# EAGLE design Board_2 (EAGLE 8.7.0)

## Sheet 1 of 3
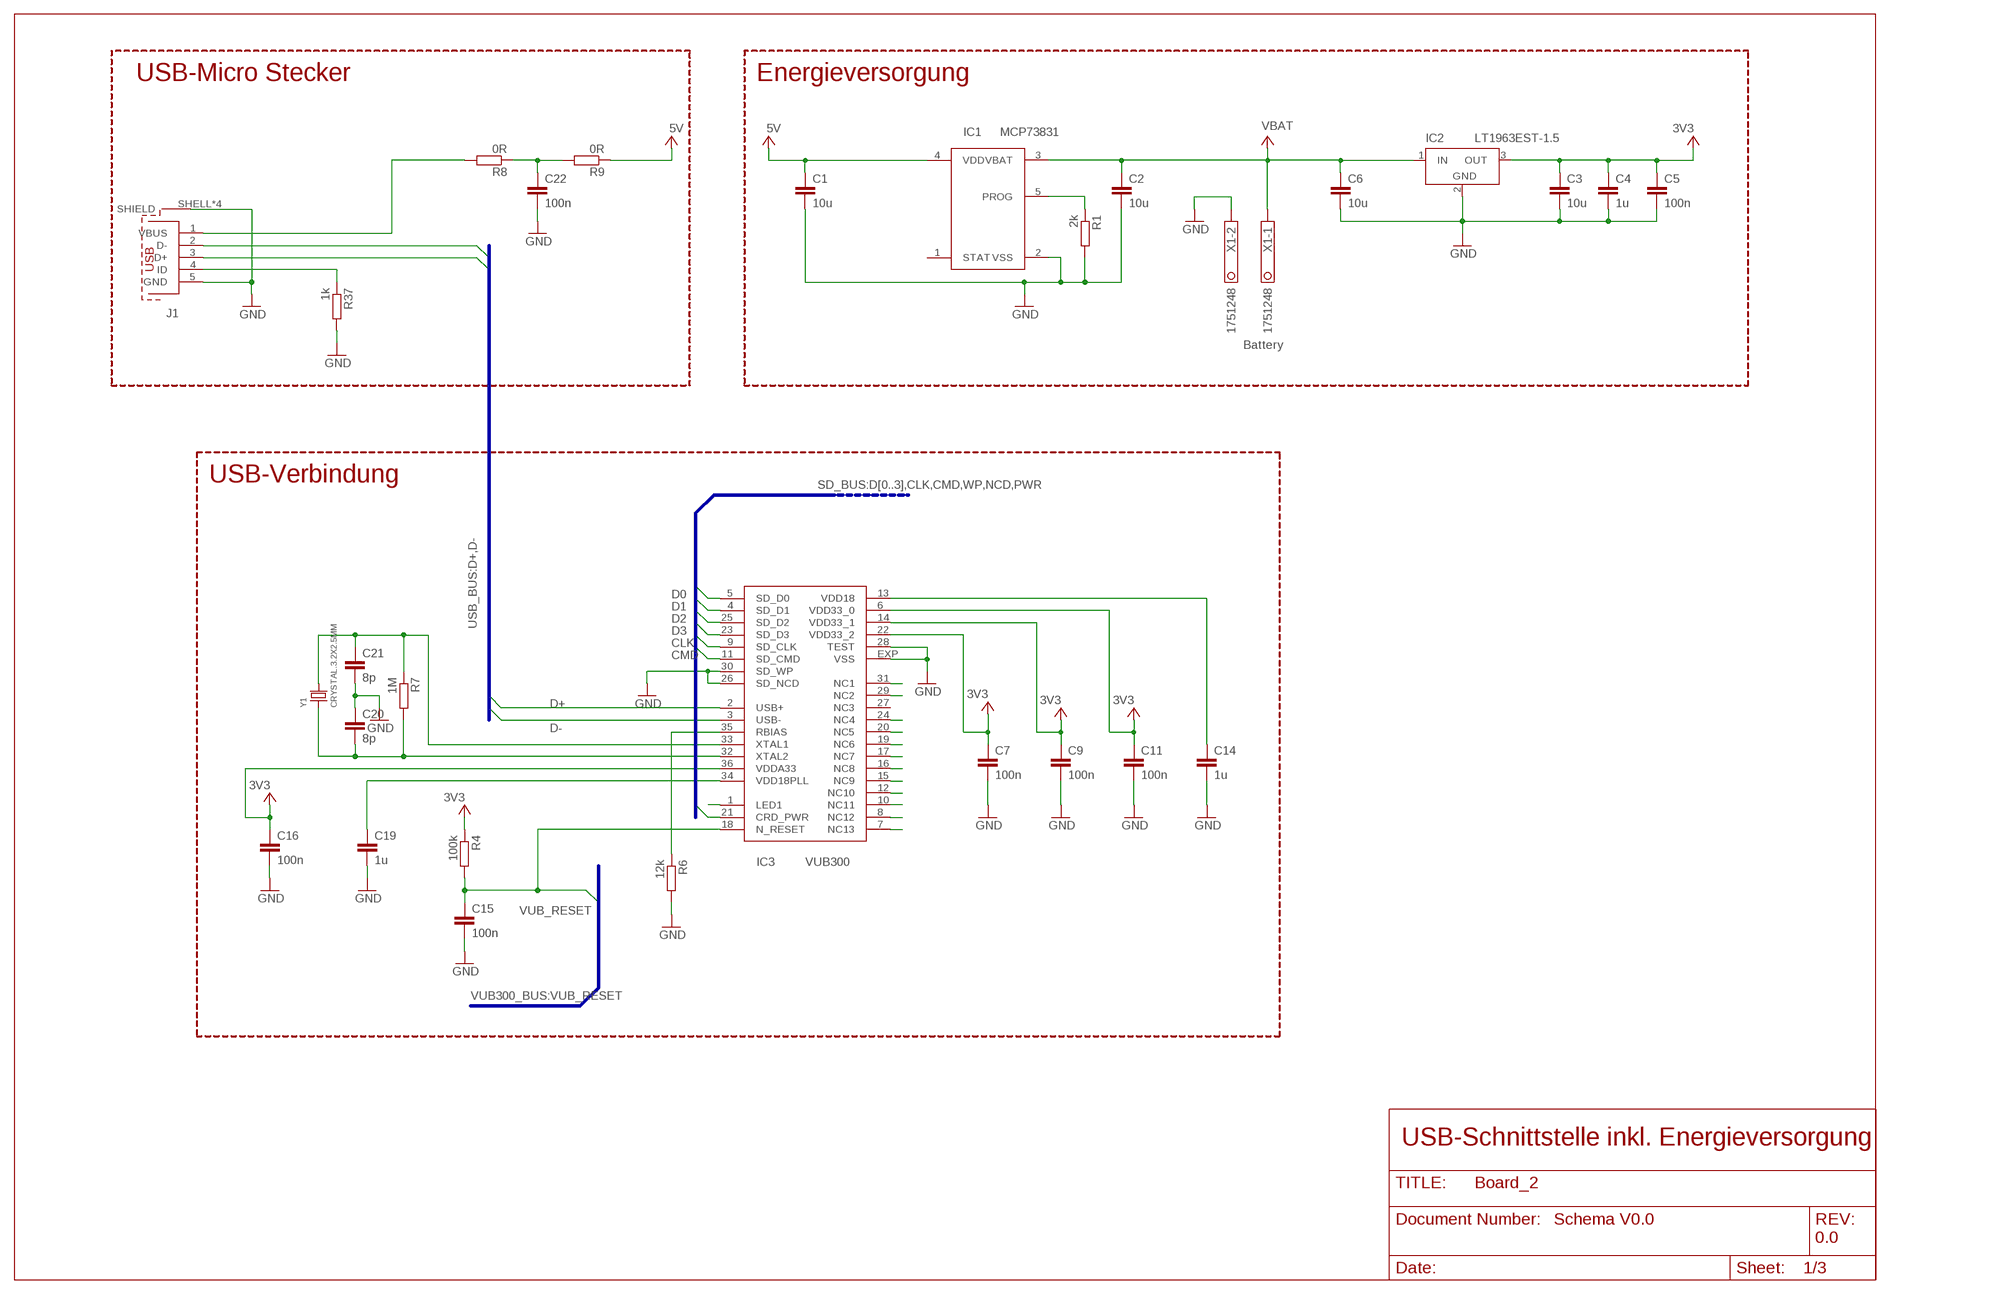
[diagram p0: schematic, sheet 1]

### Parts
C1  10u  C-EUC0805  [C0805]
C2  10u  C-EUC0805  [C0805]
C3  10u  C-EUC0805  [C0805]
C4  1u  C-EUC0603  [C0603]
C5  100n  C-EUC0603  [C0603]
C6  10u  C-EUC0805  [C0805]
C7  100n  C-EUC0402  [C0402]
C9  100n  C-EUC0402  [C0402]
C11  100n  C-EUC0402  [C0402]
C14  1u  C-EUC0402  [C0402]
C15  100n  C-EUC0402  [C0402]
C16  100n  C-EUC0402  [C0402]
C19  1u  C-EUC0402  [C0402]
C20  8p  C-EUC0402  [C0402]
C21  8p  C-EUC0402  [C0402]
C22  100n  C-EUC0603  [C0603]
IC1  MCP73831  [SOT23-5]
IC2  LT1963EST-1.5  [SOT223]
IC3  VUB300  [QFN36-6X6]
J1  629105136821  [629105136821]
R1  2k  R-EU_R0603  [R0603]
R4  100k  R-EU_R0402  [R0402]
R6  12k  R-EU_R0402  [R0402]
R7  1M  R-EU_R0402  [R0402]
R8  0R  R-EU_R0603  [R0603]
R9  0R  R-EU_R0603  [R0603]
R37  1k  R-EU_R0402  [R0402]
X1  1751248  [1751248]
Y1  CRYSTAL.3.2X2.5MM  [3.2X2.5MM]

### Nets
+3V3: C3.1 C4.1 C5.1 C7.1 C9.1 C11.1 C16.1 IC2.3(OUT) IC3.6(VDD33_0) IC3.14(VDD33_1) IC3.22(VDD33_2) IC3.36(VDDA33) R4.1 ; supply symbol labelled 3V3 ; also sheet 2,3
+5V: C1.1 IC1.4(VDD) R9.1 ; supply symbol labelled 5V
CLK: IC3.9(SD_CLK) ; also sheet 2
CMD: IC3.11(SD_CMD) ; also sheet 2
D0: IC3.5(SD_D0) ; also sheet 2
D1: IC3.4(SD_D1) ; also sheet 2
D2: IC3.25(SD_D2) ; also sheet 2
D3: IC3.23(SD_D3) ; also sheet 2
D+: IC3.2(USB+) J1.3(D+)
D-: IC3.3(USB-) J1.2(D-)
GND: C1.2 C2.2 C3.2 C4.2 C5.2 C6.2 C7.2 C9.2 C11.2 C14.2 C15.2 C16.2 C19.2 C20.1 C21.2 C22.2 IC1.2(VSS) IC2.2(GND) IC3.26(SD_NCD) IC3.28(TEST) IC3.30(SD_WP) IC3.EXP(VSS) J1.5(GND) J1.SHELL1(SHIELD) J1.SHELL2(SHIELD) J1.SHELL3(SHIELD) J1.SHELL(SHIELD) R1.2 R6.2 R37.2 X1.2 ; also sheet 2,3
N$1: IC1.5(PROG) R1.1
N$4: IC3.1(LED1)
N$5: J1.4(ID) R37.1
N$19: IC3.8(NC12)
N$20: IC3.7(NC13)
N$21: IC3.10(NC11)
N$22: IC3.12(NC10)
N$23: IC3.24(NC4)
N$24: IC3.15(NC9)
N$25: IC3.16(NC8)
N$26: IC3.17(NC7)
N$29: IC3.19(NC6)
N$30: IC3.20(NC5)
N$31: IC3.35(RBIAS) R6.1
N$32: IC3.29(NC2)
N$33: IC3.31(NC1)
N$34: J1.1(VBUS) R8.2
N$35: C20.2 IC3.32(XTAL2) R7.2 Y1.1
N$36: C21.1 IC3.33(XTAL1) R7.1 Y1.3
N$37: C22.1 R8.1 R9.2
PWR: IC3.21(CRD_PWR) ; also sheet 2
V+: C2.1 C6.1 IC1.3(VBAT) IC2.1(IN) X1.1 ; supply symbol labelled VBAT ; also sheet 3
VDD18: C14.1 IC3.13(VDD18)
VDD18PLL: C19.1 IC3.34(VDD18PLL)
VUB_RESET: C15.1 IC3.18(N_RESET) R4.2 ; also sheet 3
Unconnected: IC1.1(STAT) IC3.27(NC3)

### Buses
SD_BUS:D[0..3],CLK,CMD,WP,NCD,PWR
USB_BUS:D+,D-
VUB300_BUS:VUB_RESET

### Notes on the sheet
- USB-Micro Stecker | Energieversorgung
- Battery
- USB-Verbindung
- USB-Schnittstelle inkl. Energieversorgung
- Schema V0.0
- 0.0

## Sheet 2 of 3
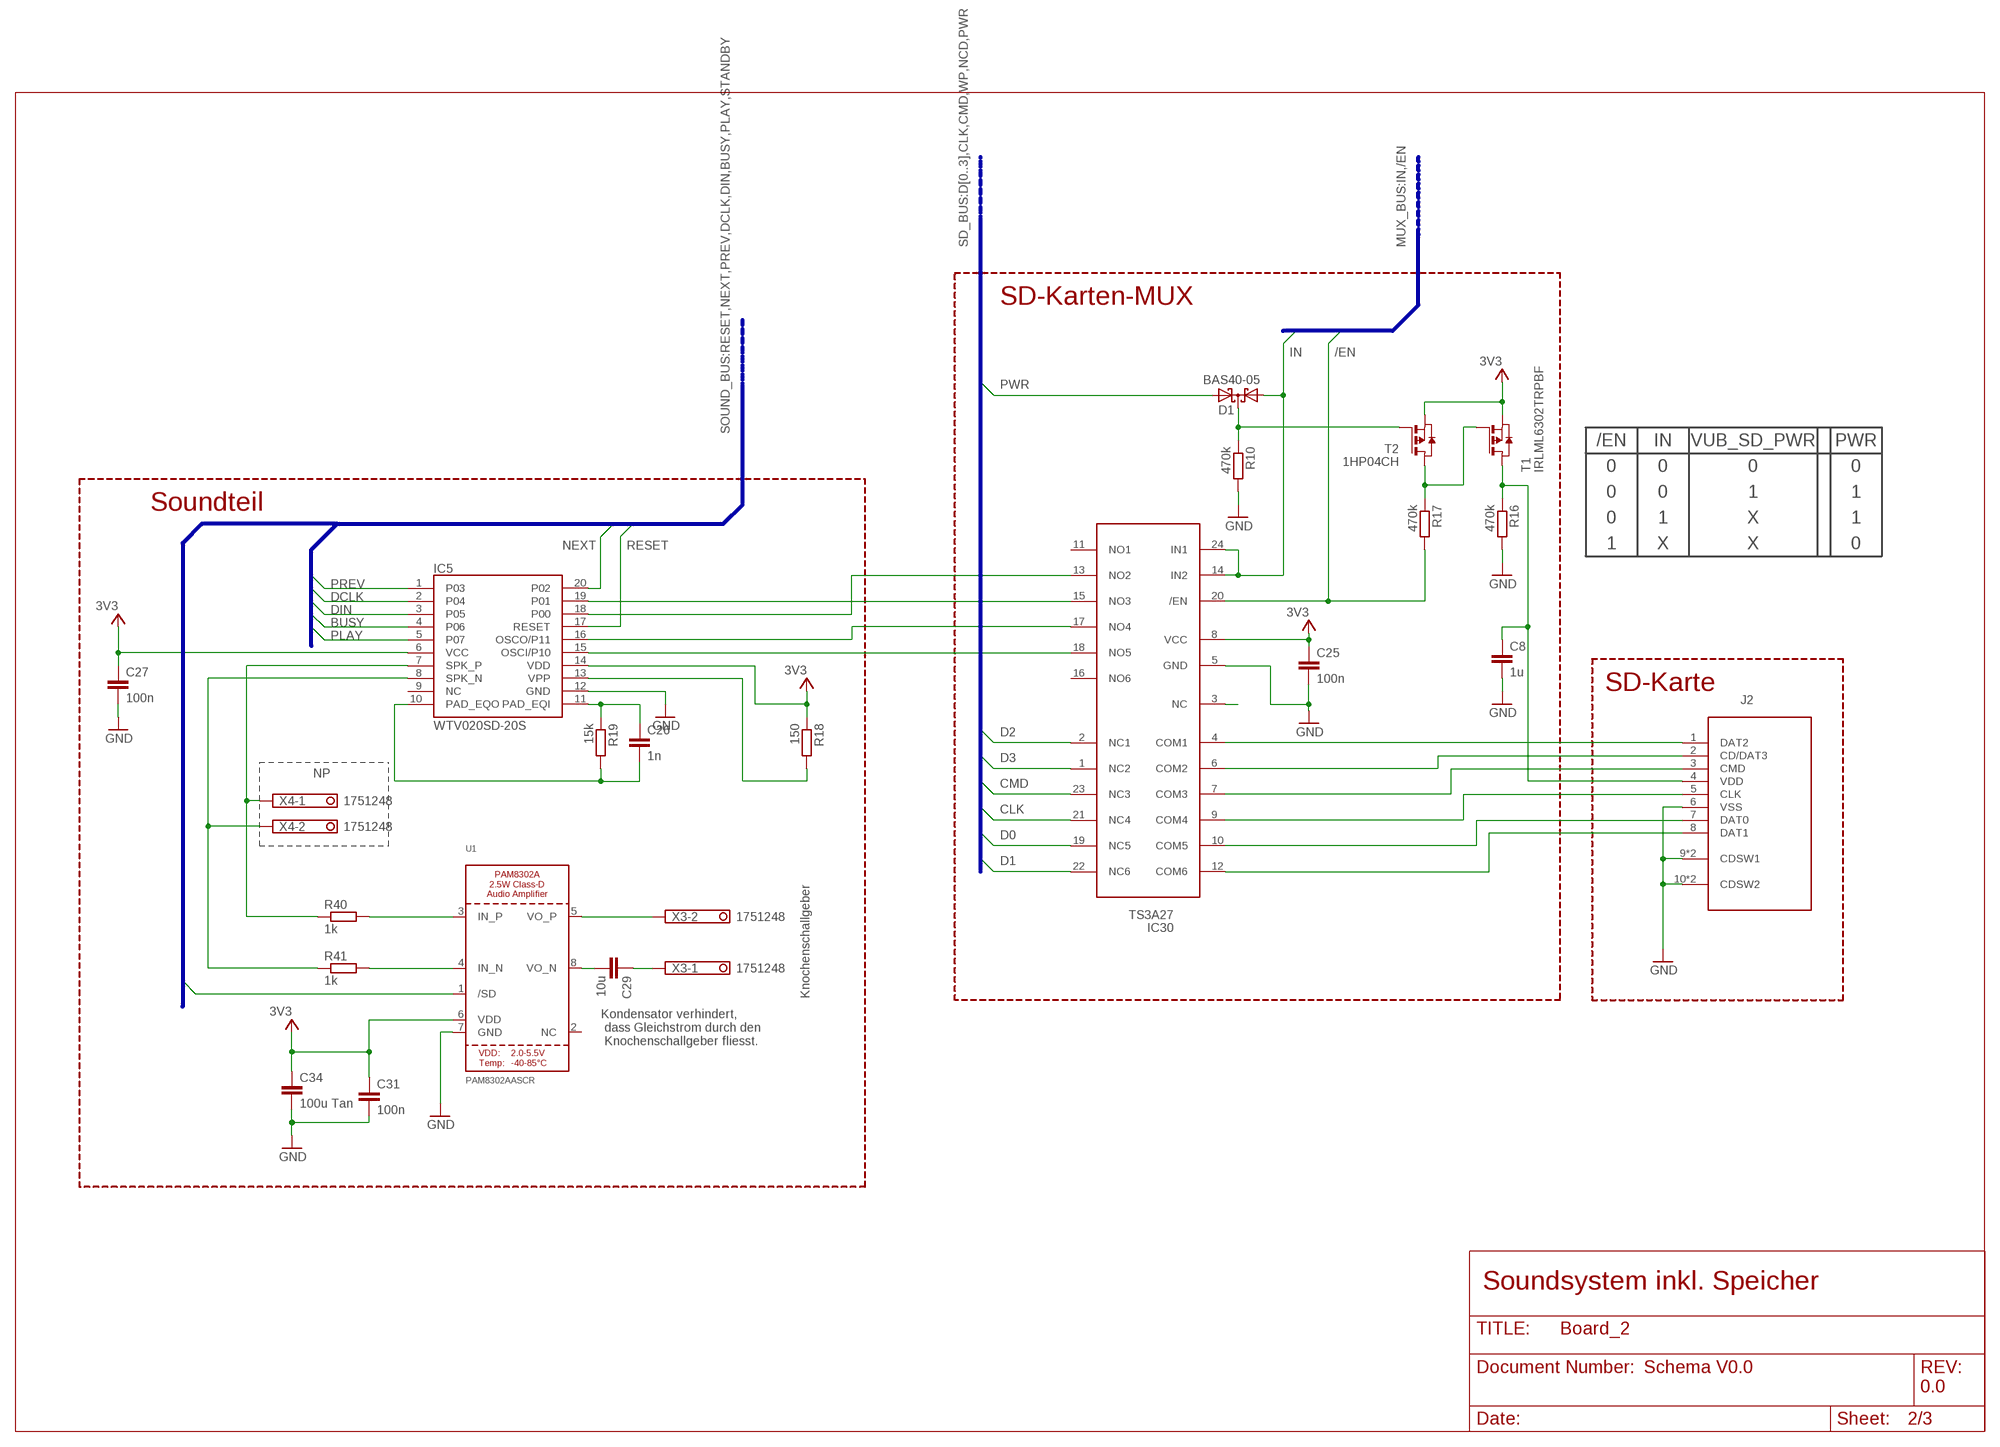
[diagram p1: schematic, sheet 2]

### Parts
C8  1u  C-EUC0603  [C0603]
C25  100n  C-EUC0603  [C0603]
C26  1n  C-EUC0402  [C0402]
C27  100n  C-EUC0402  [C0402]
C29  10u  C-EUC0603  [C0603]
C31  100n  C-EUC0603  [C0603]
C34  100u Tan  C-EUC1206  [C1206]
D1  BAS40-05  [SOT23]
IC5  WTV020SD-20S  WTV020SD  [SSOP_20]
IC30  TS3A27  [TSSOP24]
J2  693071010811  [693071010811]
R10  470k  R-EU_R0603  [R0603]
R16  470k  R-EU_R0603  [R0603]
R17  470k  R-EU_R0603  [R0603]
R18  150  R-EU_R0402  [R0402]
R19  15k  R-EU_R0402  [R0402]
R40  1k  R-EU_R0402  [R0402]
R41  1k  R-EU_R0402  [R0402]
T1  IRLML6302TRPBF  PMOSSOT23  [SOT-23]
T2  1HP04CH  PMOSSOT23  [SOT-23]
U1  PAM8302AASCR  AUDIOAMP_PAM8302A  [MSOP8_0.65MM]
X3  1751248  [1751248]
X4  1751248  [1751248]

### Nets
+3V3: C25.1 C27.1 C31.1 C34.1 IC5.6(VCC) IC5.14(VDD) IC30.8(VCC) R18.1 T1.2(S) T2.2(S) U1.6(VDD) ; supply symbol labelled 3V3 ; also sheet 1,3
/EN: IC30.20(/EN) R17.2 ; also sheet 3
BUSY: IC5.4(P06) ; also sheet 3
CLK: IC30.21(NC4) ; also sheet 1
CMD: IC30.23(NC3) ; also sheet 1
D0: IC30.19(NC5) ; also sheet 1
D1: IC30.22(NC6) ; also sheet 1
D2: IC30.2(NC1) ; also sheet 1
D3: IC30.1(NC2) ; also sheet 1
DCLK: IC5.2(P04) ; also sheet 3
DIN: IC5.3(P05) ; also sheet 3
GND: C8.2 C25.2 C27.2 C31.2 C34.2 IC5.12(GND) IC30.5(GND) J2.6(VSS) J2.9(CDSW1) J2.9-1(CDSW1) J2.10(CDSW2) J2.10-1(CDSW2) R10.2 R16.2 U1.7(GND) ; also sheet 1,3
IN: D1.1(A1) IC30.14(IN2) IC30.24(IN1) ; also sheet 3
N$2: R41.2 U1.4(IN_N)
N$9: IC5.19(P01) IC30.15(NO3)
N$11: R40.2 U1.3(IN_P)
N$12: U1.5(VO_P) X3.2
N$16: C29.1 X3.1
N$18: C29.2 U1.8(VO_N)
N$38: IC30.9(COM4) J2.5(CLK)
N$39: IC5.13(VPP) R18.2
N$40: C26.1 IC5.11(PAD_EQI) R19.1
N$41: IC5.16(OSCO/P11) IC30.17(NO4)
N$42: IC5.15(OSCI/P10) IC30.18(NO5)
N$43: IC30.4(COM1) J2.1(DAT2)
N$44: IC30.12(COM6) J2.8(DAT1)
N$45: IC30.6(COM2) J2.2(CD/DAT3)
N$46: R17.1 T1.3(G) T2.1(D)
N$47: IC30.3(NC)
N$49: D1.3(C) R10.1 T2.3(G)
NCD1: C8.1 J2.4(VDD) R16.1 T1.1(D)
NEXT: IC5.20(P02) ; also sheet 3
PLAY: IC5.5(P07) ; also sheet 3
PREV: IC5.1(P03) ; also sheet 3
PWM: C26.2 IC5.10(PAD_EQO) R19.2
PWR: D1.2(A2) ; also sheet 1
RESET: IC5.17(RESET) ; also sheet 3
SDCS: IC5.18(P00) IC30.13(NO2)
SDDI: IC30.7(COM3) J2.3(CMD)
SDDO: IC30.10(COM5) J2.7(DAT0)
SPK+: IC5.7(SPK_P) R40.1 X4.1
SPK-: IC5.8(SPK_N) R41.1 X4.2
Unconnected: IC5.9(NC) IC30.11(NO1) IC30.16(NO6) U1.1(/SD) U1.2(NC)

### Buses
SD_BUS:D[0..3],CLK,CMD,WP,NCD,PWR
MUX_BUS:IN,/EN
SOUND_BUS:RESET,NEXT,PREV,DCLK,DIN,BUSY,PLAY,STANDBY

### Notes on the sheet
- SD-Karten-MUX
- /EN | IN | VUB_SD_PWR | PWR
- 0 | 0 | 0 | 0
- 0 | 0 | 1 | 1
- Soundteil
- 0 | 1 | X | 1
- 1 | X | X | 0
- SD-Karte
- NP
- Knochenschallgeber
- Kondensator verhindert,
   dass Gleichstrom durch den
   Knochenschallgeber fliesst.
- Soundsystem inkl. Speicher
- Schema V0.0
- 0.0

## Sheet 3 of 3
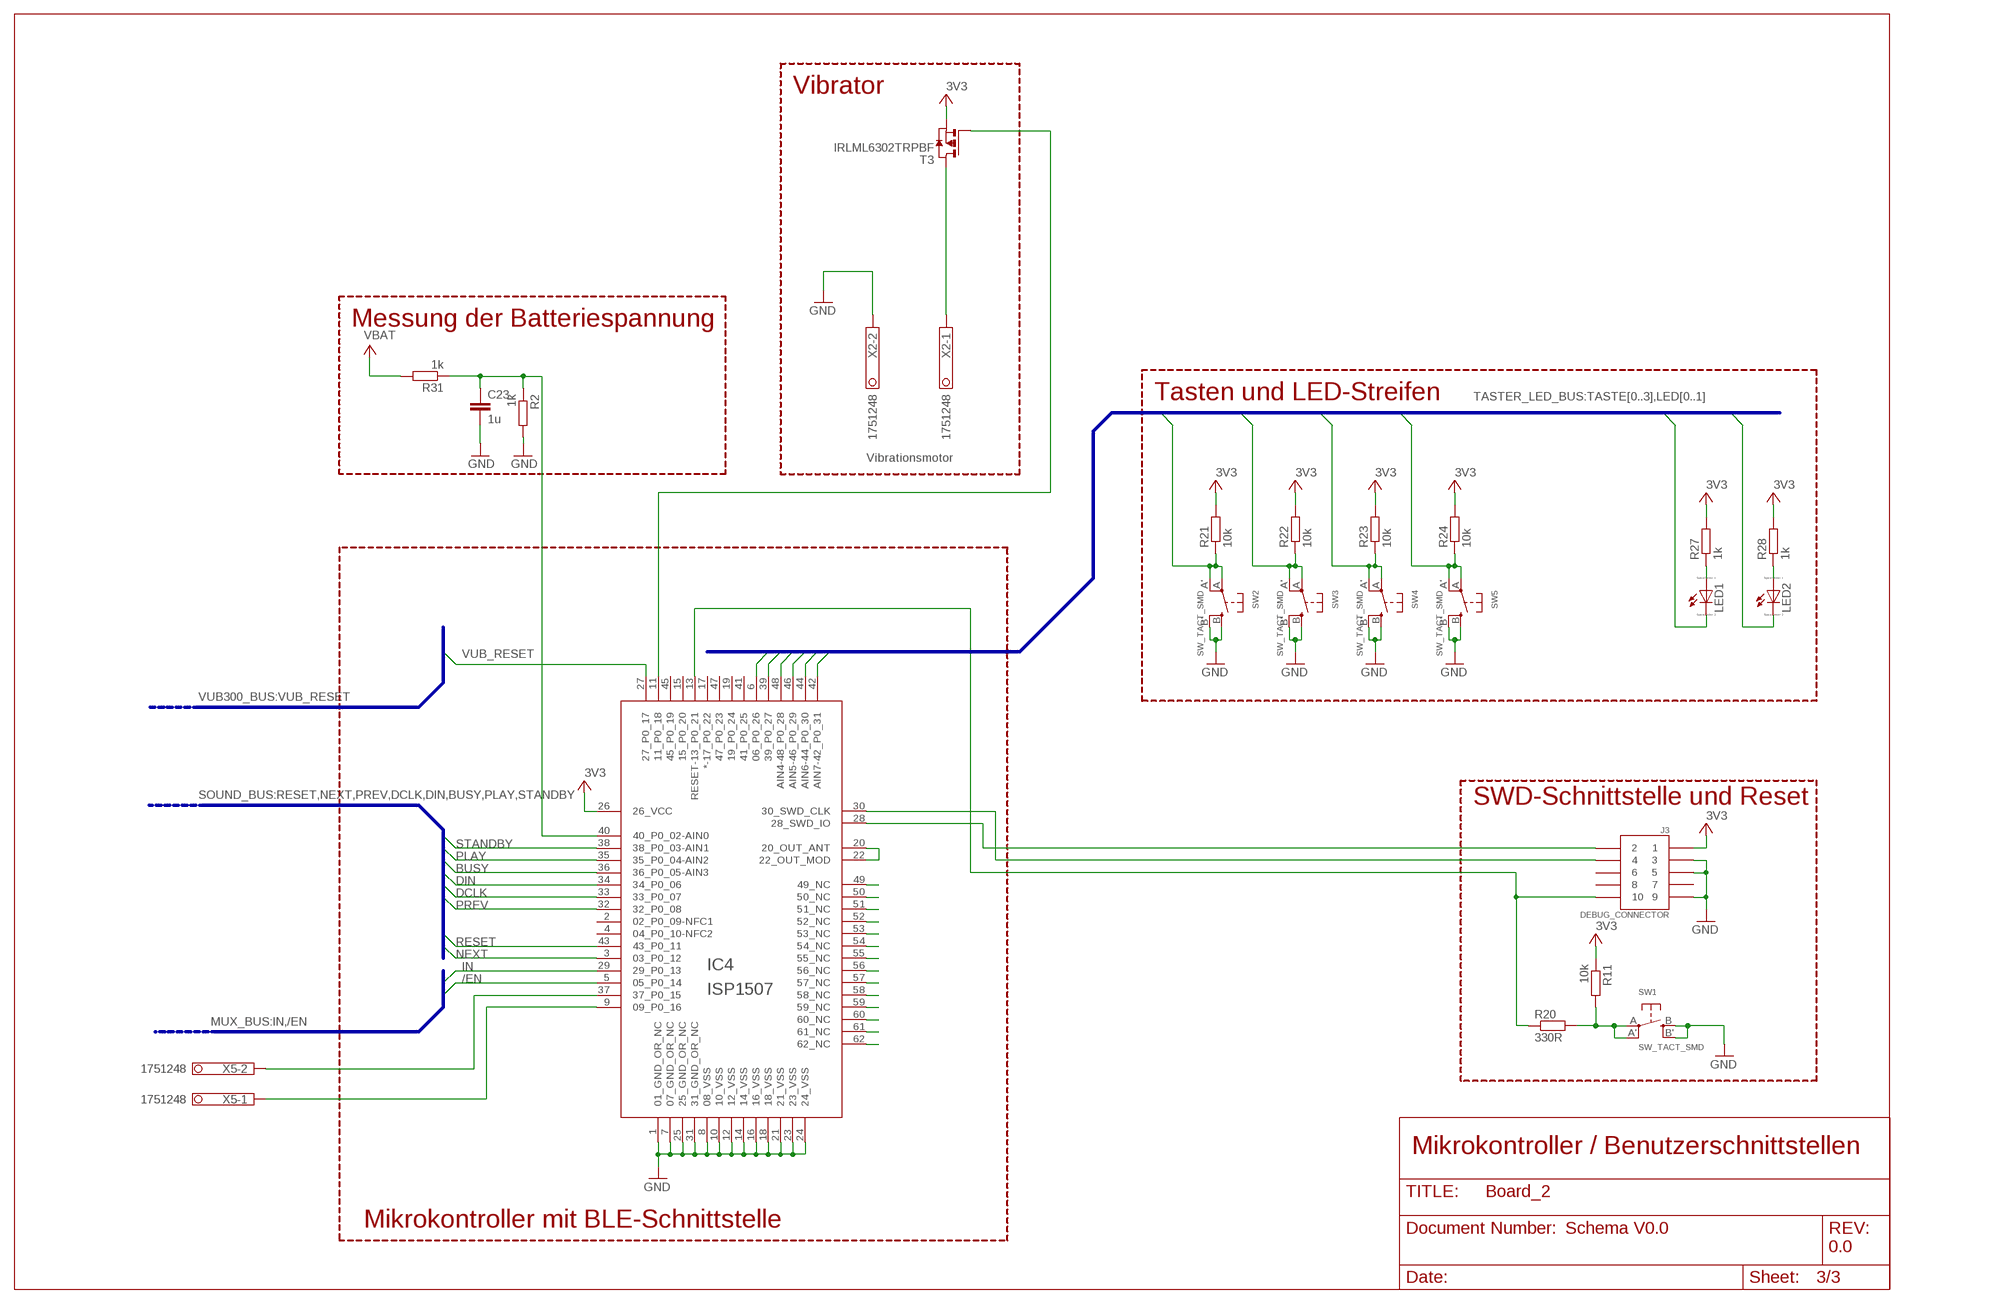
[diagram p2: schematic, sheet 3]

### Parts
C23  1u  C-EUC0603  [C0603]
IC4  ISP1507  [ISP1507]
J3  DEBUG_CONNECTOR  [HDRV127P5X2-10_N]
LED1  LED_E  [LED_1206]
LED2  LED_E  [LED_1206]
R2  1k  R-EU_R0603  [R0603]
R11  10k  R-EU_R0603  [R0603]
R20  330R  R-EU_R0603  [R0603]
R21  10k  R-EU_R0603  [R0603]
R22  10k  R-EU_R0603  [R0603]
R23  10k  R-EU_R0603  [R0603]
R24  10k  R-EU_R0603  [R0603]
R27  1k  R-EU_R0603  [R0603]
R28  1k  R-EU_R0603  [R0603]
R31  1k  R-EU_R0603  [R0603]
SW1  SW_TACT_SMD  [EVQ-Q2]
SW2  SW_TACT_SMD  [EVQ-Q2]
SW3  SW_TACT_SMD  [EVQ-Q2]
SW4  SW_TACT_SMD  [EVQ-Q2]
SW5  SW_TACT_SMD  [EVQ-Q2]
T3  IRLML6302TRPBF  PMOSSOT23  [SOT-23]
X2  1751248  [1751248]
X5  1751248  [1751248]

### Nets
+3V3: IC4.26(26_VCC) J3.1 R11.1 R21.2 R22.2 R23.2 R24.2 R27.2 R28.2 T3.2(S) ; supply symbol labelled 3V3 ; also sheet 1,2
/EN: IC4.5(05_P0_14) ; also sheet 2
BUSY: IC4.36(36_P0_05-AIN3) ; also sheet 2
DCLK: IC4.33(33_P0_07) ; also sheet 2
DIN: IC4.34(34_P0_06) ; also sheet 2
GND: C23.2 IC4.1(01_GND_OR_NC) IC4.7(07_GND_OR_NC) IC4.8(08_VSS) IC4.10(10_VSS) IC4.12(12_VSS) IC4.14(14_VSS) IC4.16(16_VSS) IC4.18(18_VSS) IC4.21(21_VSS) IC4.23(23_VSS) IC4.24(24_VSS) IC4.25(25_GND_OR_NC) IC4.31(31_GND_OR_NC) J3.3 J3.5 J3.9 R2.2 SW1.B'(S1) SW1.B(S) SW2.B'(S1) SW2.B(S) SW3.B'(S1) SW3.B(S) SW4.B'(S1) SW4.B(S) SW5.B'(S1) SW5.B(S) X2.2 ; also sheet 1,2
IN: IC4.29(29_P0_13) ; also sheet 2
LED0: IC4.39(39_P0_27) LED1.C
LED1: IC4.6(06_P0_26) LED2.C
N$3: IC4.37(37_P0_15) X5.2
N$6: IC4.20(20_OUT_ANT) IC4.22(22_OUT_MOD)
N$7: IC4.11(11_P0_18) T3.3(G)
N$13: IC4.49(49_NC)
N$15: IC4.50(50_NC)
N$17: IC4.9(09_P0_16) X5.1
N$27: IC4.51(51_NC)
N$48: R11.2 R20.2 SW1.A'(P1) SW1.A(P)
N$50: IC4.30(30_SWD_CLK) J3.4
N$51: IC4.52(52_NC)
N$52: IC4.53(53_NC)
N$53: IC4.28(28_SWD_IO) J3.2
N$54: LED1.A R27.1
N$55: C23.1 IC4.40(40_P0_02-AIN0) R2.1 R31.1
N$56: IC4.54(54_NC)
N$57: IC4.55(55_NC)
N$58: IC4.56(56_NC)
N$59: IC4.57(57_NC)
N$60: IC4.58(58_NC)
N$61: LED2.A R28.1
N$62: IC4.59(59_NC)
N$64: IC4.60(60_NC)
N$65: T3.1(D) X2.1
N$66: IC4.61(61_NC)
N$67: IC4.62(62_NC)
N$68: IC4.13(RESET-13_P0_21) J3.10 R20.1
NEXT: IC4.3(03_P0_12) ; also sheet 2
PLAY: IC4.35(35_P0_04-AIN2) ; also sheet 2
PREV: IC4.32(32_P0_08) ; also sheet 2
RESET: IC4.43(43_P0_11) ; also sheet 2
STANDBY: IC4.38(38_P0_03-AIN1) ; also sheet 2
TASTE0: IC4.42(AIN7-42_P0_31) R21.1 SW2.A'(P1) SW2.A(P)
TASTE1: IC4.44(AIN6-44_P0_30) R22.1 SW3.A'(P1) SW3.A(P)
TASTE2: IC4.46(AIN5-46_P0_29) R23.1 SW4.A'(P1) SW4.A(P)
TASTE3: IC4.48(AIN4-48_P0_28) R24.1 SW5.A'(P1) SW5.A(P)
V+: R31.2 ; supply symbol labelled VBAT ; also sheet 1
VUB_RESET: IC4.27(27_P0_17) ; also sheet 1
Unconnected: IC4.2(02_P0_09-NFC1) IC4.4(04_P0_10-NFC2) IC4.15(15_P0_20) IC4.17(*-17_P0_22) IC4.19(19_P0_24) IC4.41(41_P0_25) IC4.45(45_P0_19) IC4.47(47_P0_23) J3.6 J3.7 J3.8

### Buses
SOUND_BUS:RESET,NEXT,PREV,DCLK,DIN,BUSY,PLAY,STANDBY
MUX_BUS:IN,/EN
TASTER_LED_BUS:TASTE[0..3],LED[0..1]
VUB300_BUS:VUB_RESET

### Notes on the sheet
- Vibrator
- Messung der Batteriespannung
- Tasten und LED-Streifen
- Vibrationsmotor
- SWD-Schnittstelle und Reset
- Mikrokontroller / Benutzerschnittstellen
- Mikrokontroller mit BLE-Schnittstelle
- Schema V0.0
- 0.0

## Power pins joined to a net without a drawn wire
GND: IC2.4(GND)

## Library data of the parts
C1-C9 C11 C14-C16 C19-C23 C25-C27 C29 C31 C34 = rcl:C-EU: CAPACITOR, European symbol; SPICEPREFIX: C
D1 = diode:BAS40-05: Silicon Schottky Diodes General-purpose diode for high-speed switching
IC1 = mcp73831:MCP73831
IC2 = linear-technology:LT1963EST: 1.5A, Low Noise, Fast Transient Response LDO Regulator Source: http://www.linear.com/pc/downloadDocument.do?navId=H0,C3,P2222,D3148; MPN: LT1963EST-1.5; OC_FARNELL: 1663528; OC_NEWARK: 57M7534
IC3 = VUB300:VUB300
IC4 = ISP1507_Eagle_Library:ISP1507: ISP1507 BT Low Energie Module Based on the nRF52 BT Low Energie IC. Integrated antenna, oszillators, and power supply. http://www.insightsip.com/products/bluetooth-smart-modules/isp1507
IC5 = SparkFun-DigitalIC:WTV020SD: SD audio playback IC Can play back .wav or .ad4 files from an SD card SPI control or digital input trigger control available in SSOP-20 or DIP-20; PROD_#: NA; PROD_ID: IC-11012; SKU: NA; SPARKLE_ID: 6000
IC30 = TS3a27:TS3A27
J1 = USBZueg:629105136821: WR-COM SMT Horizontal 5 Contacts Micro USB Type B,5 pins=>Code : Con_I-O_COM_MicroUSB_629105136821 <http://katalog.we-online.de/media/images/eican/Con_I-O_COM_MicroUSB_629105136821_pf2.jpg> Details see: http://katalog.we-online.de/en/em/COM_MICRO_SMT_TYPE_B_HORIZONTAL/629105136821?m Created 2014-07-09, Karrer Zheng 2014 (C) Würth Elektronik
J2 = InputOutputIO (rev18a)(1):693071010811: WR-CRD MICRO SD CARD CONNECTOR PUSH & PUSH WITH CARD DETECTION 8PINS=>Code : Con_I-O_COM_CRD_SD_Micro_693071010811 <http://katalog.we-online.de/media/images/eican/Con_I-O_COM_CRD_SD_Micro_693071010811_pf2.jpg> Details see: http://katalog.we-online.de/en/em/CRD_SD_MICRO_PUSH_AND_PULL_8_PINS/693071010811 Created 2014-07-09, Karrer Zheng 2014 (C) Würth Elektronik
J3 = Nordic_misc:DEBUG_CONNECTOR
LED1 LED2 = eagle-ltspice:LED_E: LED Source: http://www.osram.convergy.de Source: www.luxeon.com Source: www.kingbright.com; SPICEMODEL: NONE; SPICEPREFIX: D; SPICETYPE: diode
R1 R2 R4 R6-R11 R16-R24 R27 R28 R31 R37 R40 R41 = resistor:R-EU_: RESISTOR, European symbol
SW1-SW5 = Pro3E:SW_TACT_SMD
T1-T3 = zetex:PMOSSOT23: MOS FET; OC_FARNELL: unknown; OC_NEWARK: unknown
U1 = microbuilder:AUDIOAMP_PAM8302A: PAM8302A - 2.5W Class-D Mono Audio Amplifier MSOP8 = PAM8302AASCR
X1-X5 = con-phoenix-350:1751248: MKDS 1/ 2-3,5 Printklemme Nennstrom: 10 A Bemessungsspannung: 160 V Raster: 3,5 mm Polzahl: 2 Montageart: Löten Anschlussart: Schraubanschluss Anschlussrichtung vom Leiter zur Platine: 0° Source: http://eshop.phoenixcontact.com .. 1751248.pdf; OC_FARNELL: unknown; OC_NEWARK: unknown
Y1 = abracom:CRYSTAL

## Board
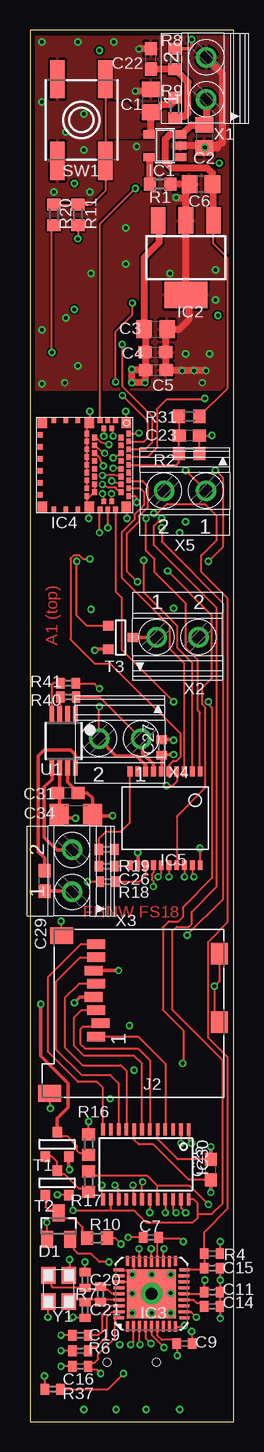
[diagram p3: board, top side]
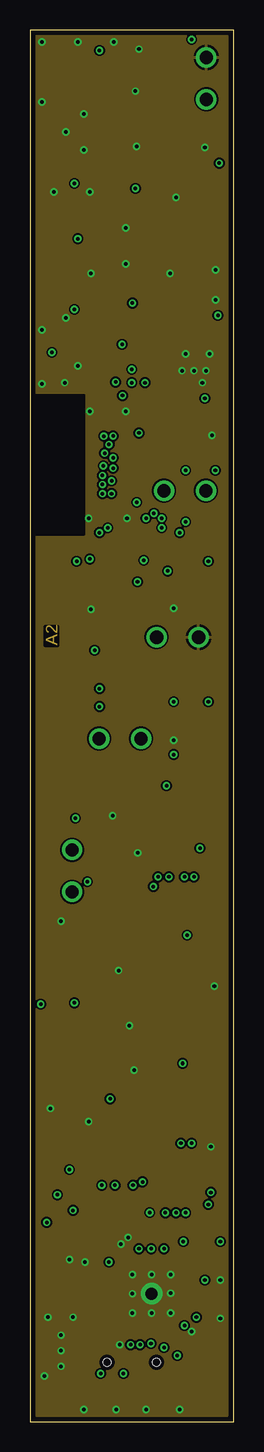
[diagram p4: board, inner layer A2]
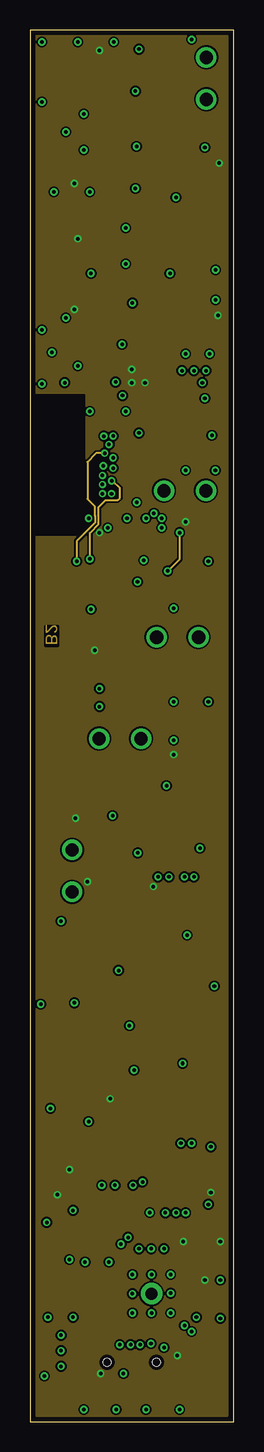
[diagram p5: board, inner layer B2]
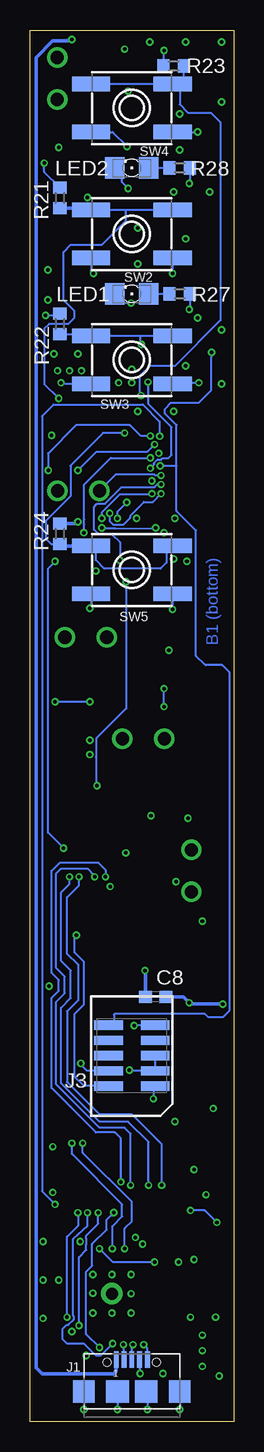
[diagram p6: board, bottom side, seen from below]

Size 17 x 116 mm. Coordinates in mm from the lower left corner, seen from the top.
Outline: 0,0 17,0 17,116 0,116 0,0
Copper layers (1+2*15+16): A1 0.035mm / dielectric 0.38mm / A2 0.035mm / dielectric 0.71mm / B2 0.035mm / dielectric 0.38mm / B1 0.035mm
Design rules "PCB-POOL Standard_ML4": minimum track width 0.15mm, minimum drill 0.3mm, track to track 0.15mm, track to pad 0.15mm, pad to pad 0.15mm, via to via 0.15mm, smd to smd 0.15mm, copper to edge 0.3mm, drill to drill 0.2mm, minimum pad ring 0.2mm, minimum via ring 0.15mm, stop-mask expansion 0.075mm, vias tented up to drill 0mil, thermal gap 0.2mm

### Footprints (pad centres in the part's own frame; a part is rotated, then mirrored left to right if it is on the bottom)
C0805 = smd 1.3 x 1.5: 1 -0.95,0; 2 0.95,0
C0603 = smd 1.1 x 1: 1 -0.85,0; 2 0.85,0
C0402 = smd 0.7 x 0.9: 1 -0.65,0; 2 0.65,0
C1206 = smd 1.6 x 1.8: 1 -1.4,0; 2 1.4,0
SOT23 = smd 1 x 1.4: 1 -0.95,-1.1; 2 0.95,-1.1; 3 0,1.1
SOT23-5 = smd 0.69 x 0.99: 1 -0.95,-1.29; 2 0,-1.29; 3 0.95,-1.29; 4 0.95,1.3; 5 -0.95,1.3
SOT223 = smd 1.219 x 2.235: 1 -2.311,-3.099; 2 0,-3.099; 3 2.311,-3.099 | smd 3.6 x 2.2: 4 0,3.099
QFN36-6X6 = smd 0.28 x 0.84: 1 -2,-2.735; 9 2,-2.735; 19 2,2.735; 27 -2,2.735 | smd 0.28 x 0.89: 2 -1.5,-2.71; 3 -1,-2.71; 4 -0.5,-2.71; 5 0,-2.71; 6 0.5,-2.71; 7 1,-2.71; 8 1.5,-2.71; 20 1.5,2.71; 21 1,2.71; 22 0.5,2.71; 23 0,2.71; 24 -0.5,2.71; 25 -1,2.71; 26 -1.5,2.71 | smd 0.84 x 0.28: 10 2.735,-2; 18 2.735,2; 28 -2.735,2; 36 -2.735,-2 | smd 0.89 x 0.28: 11 2.71,-1.5; 12 2.71,-1; 13 2.71,-0.5; 14 2.71,0; 15 2.71,0.5; 16 2.71,1; 17 2.71,1.5; 29 -2.71,1.5; 30 -2.71,1; 31 -2.71,0.5; 32 -2.71,0; 33 -2.71,-0.5; 34 -2.71,-1; 35 -2.71,-1.5 | smd 4.1 x 4.1: EXP 0,0
ISP1507 = smd 0.8 x 0.8: 1 0.5,7.5; 7 0.5,4.4; 25 7.5,4.4; 31 7.5,7.5; 52 0.5,0.5; 59 7.5,0.5 | smd 0.4 x 0.4: 2 0.3,6.6; 3 0.95,6.275; 4 0.3,5.95; 5 0.95,5.625; 6 0.3,5.3; 8 1.4,4.2; 9 1.725,4.85; 10 2.05,4.2; 11 2.375,4.85; 12 2.7,4.2; 13 3.025,4.85; 14 3.35,4.2; 15 3.675,4.85; 16 4,4.2; 17 4.325,4.85; 18 4.65,4.2; 19 4.975,4.85; 20 5.3,4.2; 21 5.625,4.85; 22 5.95,4.2; 23 6.275,4.85; 24 6.6,4.2; 26 7.7,5.3; 27 7.05,5.625; 28 7.7,5.95; 29 7.05,6.275; 30 7.7,6.6; 32 6.6,7.7; 33 6.275,7.05; 34 5.95,7.7; 35 5.625,7.05; 36 5.3,7.7; 37 4.975,7.05; 38 4.65,7.7; 39 4.325,7.05; 40 4,7.7; 41 3.675,7.05; 42 3.35,7.7; 43 3.025,7.05; 44 2.7,7.7; 45 2.375,7.05; 46 2.05,7.7; 47 1.725,7.05; 48 1.4,7.7; 49 0.3,3.45; 50 0.3,2.45; 51 0.3,1.45; 53 1.5,0.3; 54 2.5,0.3; 55 3.5,0.3; 56 4.5,0.3; 57 5.5,0.3; 58 6.5,0.3; 60 7.7,1.45; 61 7.7,2.45; 62 7.7,3.45
SSOP_20 = smd 0.813 x 0.406: 1 -3.9,2.925; 2 -3.9,2.275; 3 -3.9,1.625; 4 -3.9,0.975; 5 -3.9,0.325; 6 -3.9,-0.325; 7 -3.9,-0.975; 8 -3.9,-1.625; 9 -3.9,-2.275; 10 -3.9,-2.925; 11 3.9,-2.925; 12 3.9,-2.275; 13 3.9,-1.625; 14 3.9,-0.975; 15 3.9,-0.325; 16 3.9,0.325; 17 3.9,0.975; 18 3.9,1.625; 19 3.9,2.275; 20 3.9,2.925
TSSOP24 = smd 0.305 x 0.991: 1 -3.575,-2.918; 2 -2.925,-2.918; 3 -2.275,-2.918; 4 -1.625,-2.918; 5 -0.975,-2.918; 6 -0.325,-2.918; 7 0.325,-2.918; 8 0.975,-2.918; 9 1.625,-2.918; 10 2.275,-2.918; 11 2.925,-2.918; 12 3.575,-2.918; 13 3.575,2.918; 14 2.925,2.918; 15 2.275,2.918; 16 1.625,2.918; 17 0.975,2.918; 18 0.325,2.918; 19 -0.325,2.918; 20 -0.975,2.918; 21 -1.625,2.918; 22 -2.275,2.918; 23 -2.925,2.918; 24 -3.575,2.918
629105136821 = smd 0.4 x 1.35: 1 -1.3,2.675; 2 -0.65,2.675; 3 0,2.675; 4 0.65,2.675; 5 1.3,2.675 | smd 1.8 x 1.9: SHELL -4,0; SHELL3 4,0 | smd 1.9 x 1.9: SHELL1 -1.2,0; SHELL2 1.2,0 | hole 0.65: -2.075,2.45; 2.075,2.45
693071010811 = smd 0.8 x 1.5: 1 0,0; 2 1.1,-0.4; 3 2.2,0; 4 3.3,0.2; 5 4.4,0; 6 5.5,0.2; 7 6.6,0; 8 7.7,0 | smd 1.4 x 1.9: 9 -4.75,3.85; 9-1 8.4,2.85 | smd 1.8 x 1.4: 10 1.19,-10.3; 10-1 6.89,-10.3
HDRV127P5X2-10_N = smd 0.76 x 2.4: 1 -2.54,-1.95; 2 -2.54,1.95; 3 -1.27,-1.95; 4 -1.27,1.95; 5 0,-1.95; 6 0,1.95; 7 1.27,-1.95; 8 1.27,1.95; 9 2.54,-1.95; 10 2.54,1.95
LED_1206 = smd 1.6 x 1.803: A -1.422,0; C 1.422,0
R0603 = smd 1 x 1.1: 1 -0.85,0; 2 0.85,0
R0402 = smd 0.7 x 0.9: 1 -0.65,0; 2 0.65,0
EVQ-Q2 = smd 3.2 x 1.2: A -3.4,-2; A' 3.4,-2; B -3.4,2; B' 3.4,2
SOT-23 = smd 0.787 x 0.889: 1 0.025,-1.016; 2 -0.94,1.016; 3 0.991,1.016
MSOP8_0.65MM = smd 0.4 x 1.4: 1 -0.975,-2.2; 2 -0.325,-2.2; 3 0.325,-2.2; 4 0.975,-2.2; 5 0.975,2.2; 6 0.325,2.2; 7 -0.325,2.2; 8 -0.975,2.2
1751248 = drill 1.1 pad 1.7: 1 -1.75,-0.1; 2 1.75,-0.1
3.2X2.5MM = smd 1.4 x 1.2: 1 -1.1,-0.85; 2 1.1,-0.85; 3 1.1,0.85; 4 -1.1,0.85

### Placement (x,y rotation side)
C1  10.1,110.1 90 top
C2  14.56,107.12 270 top
C3  10.5,91.06 0 top
C4  10.48,89.15 0 top
C5  10.52,87.66 0 top
C6  14.28,103.14 180 top
C7  10.1,15.35 180 top
C8  6.5,35.4 180 bottom
C9  12.9,6.5 0 top
C11  15.2,10.8 0 top
C14  15.2,9.6 0 top
C15  15.2,12.8 0 top
C16  4.2,4.6 180 top
C19  4.2,7.2 180 top
C20  4.6,11.8 270 top
C21  4.6,9.3 270 top
C22  10.1,113.6 90 top
C23  13.3,82.2 0 top
C25  15.1,21 90 top
C26  6.4,46.3 180 top
C27  11,56.2 90 top
C29  1.21,45.06 90 top
C31  3.17,52.41 0 top
C34  3.84,50.56 0 top
D1  2.4,16.3 0 top
IC1  11.26,106.35 90 top
IC2  13.02,97.02 180 top
IC3  10.15,10.65 0 top
IC4  0.55,83.75 270 top
IC5  11.28,50.28 270 top
IC30  9.68,21.43 180 top
J1  8.5,2.5 0 bottom
J2  5.5,32.1 90 top
J3  8.5,30.5 90 bottom
LED1  8.5,94 180 bottom
LED2  8.5,104.5 180 bottom
R1  10.86,103.15 0 top
R2  13.3,80.7 0 top
R4  15.2,14 180 top
R6  4.2,5.9 180 top
R7  5.9,10.6 90 top
R8  12.1,113.6 90 top
R9  12.1,109.5 270 top
R10  5.6,15.3 0 top
R11  4,100.6 90 top
R16  4.9,23.1 90 top
R17  4.9,20 90 top
R18  6.5,45 0 top
R19  6.4,47.7 180 top
R20  2,100.6 90 top
R21  14.5,102 90 bottom
R22  14.5,91.5 90 bottom
R23  5,113 180 bottom
R24  14.5,74 90 bottom
R27  4.5,94 0 bottom
R28  4.5,104.5 0 bottom
R31  13.3,83.8 0 top
R37  1.9,2.7 180 top
R40  3.2,60.4 180 top
R41  3.19,61.55 180 top
SW1  4.3,108.5 90 top
SW2  8.5,99 180 bottom
SW3  8.5,88.5 180 bottom
SW4  8.5,109.5 180 bottom
SW5  8.5,71 180 bottom
T1  2.3,23.1 180 top
T2  2.3,19.9 180 top
T3  7.57,65.33 90 top
U1  2.81,56.74 180 top
X1  14.62,111.96 90 top
X2  12.33,65.48 0 top
X3  3.42,45.9 90 top
X4  7.53,56.82 180 top
X5  12.95,77.49 180 top
Y1  2.4,11.1 270 top

### Tracks (layer width: path | path; a pad name or v marks a point on that pad's centre or on a via)
+3V3  (via drill 0.3)
  A1 0.15: IC3.36 7.1,8.65 7.1,7 5.7,5.6 5.7,5.2 5.4,4.9 5.15,4.9 C16.1 5.15,4.3 5.6,4.3 v5.9,4 | IC3.6 10.65,7.15 11,6.8 12.25,6.8 C9.1 12.25,5.55 v12.3,5.5 | R4.1 15.9,14.05 v15.9,15 | IC3.14 14.4,10.65 C11.1 14.55,11.75 v14.6,11.8 | C25.1 13.25,20.15 10.3,23.1 9.1,23.1 8.71,23.5 IC30.8 | 3.24,21.06 v3.3,21 | T2.2 2.32,18.88 v2.3,18.9 | v10.3,44.6 10.3,45.05 10.18,45.18 10.18,45.62 10.3,45.75 IC5.14 | R18.1 v4.8,45 | IC5.6 11,54.23 | C27.1 11.05,55.6 | R11.1 v4,98.6 | IC4.26 5.85,76 5.8,75.95 v5.8,74.1 | 5.49,64.39 v5.4,64.3 | C5.1 9.67,89.11 C4.1 | C7.1 10.72,15.32 | 10.72,15.32 10.75,15.3 | IC3.22 10.65,15.25 | 10.65,15.25 10.72,15.32 | v12.8,15 12.55,15.25 10.65,15.25
  A1 0.3: T1.2 3.24,21.06 | 11,54.23 C27.1 | 11.05,55.6 v12,55.6 | U1.6 2.48,52.58 | 2.48,52.58 C31.1 | 2.48,52.58 2.48,51.01 C34.1 2.3,50.3 v3.8,50.3 | C25.1 v15.1,19.1 | T3.2 5.49,64.39
  A1 0.6: C5.1 9.67,90.94 C3.1 9.55,97.05 10.8,98.3 10.8,100.03 IC2.3 | C5.1 8.54,87.66 | 8.54,87.66 v8.5,87.7 | C5.1 9.6,87.59 v9.6,86.6 v8.5,86.6 8.54,86.64 8.54,87.66
  B1 0.15: J3.1 6.7,27.81 v6.7,26.9 | R23.2 5.8,113.05 v5.8,114.3 | R28.2 3.65,103.25 v3.7,103.2 | R27.2 3.65,92.75 v3.7,92.7 | R22.2 14.65,92.2 v15.7,92.2 | R21.2 15.8,104.15 v15.8,104.9
  B1 0.3: R24.2 13.15,74.85 v13,75
  pour B2: 0.5,0.5 16.5,0.5 16.5,115.5 0.5,115.5
+5V
  A1 0.6: IC1.4 10.1,107.44 C1.1 10.35,109.15 11,109.8 11.8,109.8 12.1,110.1 R9.1
  pour A1: 10,107 5.5,107 5.5,110 8,110 8.5,109.5 10,109.5
/EN  (via drill 0.3)
  A1 0.15: R17.2 5.25,20.5 9.8,20.5 10.65,19.65 | IC30.20 10.65,19.64 10.65,19.65 | IC4.5 v6.17,82.14 | v14.9,18.1 13.35,19.65 10.65,19.65
  B1 0.15: v6.17,82.14 6.17,83.37 7.58,84.78 15.03,84.78 16,83.8 16,19.2 v14.9,18.1
BUSY  (via drill 0.3)
  A1 0.15: IC4.36 8.3,78.4 9.4,78.4 9.8,78 9.8,76.2 9.09,75.49 9.09,75.01 8.1,74.03 8.1,70.88 v8.97,70 | v11.4,53 11.9,53 12.26,53.35 IC5.4
  B1 0.15: v8.97,70 8.97,59.42 11.47,56.92 11.47,55.38 11.5,55.36 11.5,53 v11.4,53
CLK  (via drill 0.3)
  A1 0.15: IC3.9 12.81,7.92 v12.9,8 | IC30.21 v11.3,17.4
  B1 0.15: v12.9,8 12.9,13.7 12.3,14.3 12.3,14.76 12.28,14.78 12.28,15.22 12.3,15.24 12.3,15.5 11.3,16.5 v11.3,17.4
CMD  (via drill 0.3)
  A1 0.15: IC3.11 13.45,9.15 v13.9,8.7 | IC30.23 12.61,17.8 v13,17.4
  B1 0.15: v13.9,8.7 13.9,15.4 13,16.3 v13,17.4
D0  (via drill 0.3)
  A1 0.15: v11.2,6.17 10.9,6.48 10.15,7.23 IC3.5 | IC30.19 v10.01,17.43 v10,17.43
  B1 0.15: v10,17.43 10,17.4 10.2,17.2 10.22,17.2 10.6,16.82 10.6,16 11.8,14.8 11.8,13 12.3,12.5 12.3,7.28 v11.2,6.17
D1  (via drill 0.3)
  A1 0.15: IC3.4 9.65,6.95 v10.1,6.5 | IC30.22 11.96,17.64 v12.2,17.4
  B1 0.15: v10.1,6.5 11.1,5.5 11.5,5.5 12.5,6.5 13.9,6.5 14.3,6.9 14.3,7.7 13.95,8.05 13.81,8.05 13.38,8.48 13.38,8.8 | 13.38,8.8 | 13.38,8.8 13.4,15.2 13.39,15.21 12.2,16.3 v12.2,17.4 | 13.38,8.8 | 13.38,8.8
D2  (via drill 0.3)
  A1 0.15: IC3.25 9.15,14.35 v9.1,14.4 | IC30.2 v12.61,23.2 v12.6,23.2
  B1 0.15: v9.1,14.4 9.1,16.1 8.5,16.7 8.5,18.3 12.6,22.4 v12.6,23.2
D3  (via drill 0.3)
  A1 0.15: IC3.23 10.15,14.38 v10.12,14.4 | IC30.1 13.26,23.45 v13.5,23.2
  B1 0.15: v10.12,14.4 10.2,14.4 | v10.12,14.4 arc-90 10.1,14.43 | v10.12,14.4 10.12,16.27 9.3,17.1 9.3,18.1 13.5,22.3 v13.5,23.2
D+  (via drill 0.3)
  A1 0.15: v8.4,6.4 8.65,6.65 IC3.2
  B1 0.15: J1.3 8.5,6.2 v8.4,6.4
D-  (via drill 0.3)
  A1 0.15: v9.2,6.4 9.15,6.45 IC3.3
  B1 0.15: J1.2 9.15,6.25 v9.2,6.4
DCLK  (via drill 0.3)
  A1 0.15: 7.19,77.79 7.1,77.89 6.64,77.88 | 7.19,77.79 IC4.33 | v6.05,78.11 6.54,77.88 6.64,77.88 | 6.64,77.88 7.14,77.88 7.19,77.79 | IC5.2 13.55,63.24 12.3,64.5 12.3,66.3 9.5,69.1 v9.5,71.8
  B1 0.15: v6.05,78.11 6.38,78.11 6.6,77.89 9.34,77.89 10.71,76.52 11.38,76.52 11.65,76.25 11.65,74.35 11.25,73.95 10.15,73.95 9.5,73.3 v9.5,71.8
DIN
  A1 0.15: IC5.3 12.9,63.17 11.7,64.38 11.7,66.3 7.7,70.3 7.7,74.16 8.72,75.18 8.72,75.62 9.5,76.4 9.5,77.5 9.2,77.8 IC4.34
GND  (via drill 0.3, 1)
  A1 0.15: R6.2 v2.6,5.9 | C16.2 v2.6,4.6 | C19.2 v2.6,7.2 | C21.2 3.65,8.65 v3.6,8.7 | C20.1 v4.6,13.3 | C9.2 13.55,7.45 v13.5,7.5 | C14.2 15.9,9.55 v15.9,8.6 15.9,10.75 | 15.9,10.75 C11.2 | 15.9,10.75 v15.9,11.8 15.9,12.75 C15.2 | C7.2 v8.2,15.35 | v1.5,8.7 1.5,10 | v3.3,13.5 3.3,12.1 | IC3.28 7.46,12.6 8.6,12.6 | 8.6,12.6 9.2,12.6 | R37.2 1.25,3.75 v1.2,3.8 | IC3.26 8.65,12.65 8.6,12.6 | IC3.30 8.35,11.65 8.4,11.6 9.2,11.6 IC3.EXP | IC3.EXP v8.55,12.25 | IC3.EXP 8.6,12.2 8.6,12.6 | J2.9 1.65,26.15 v1.7,26.1 | J2.9-1 2.65,41.65 v2.6,41.7 | 15.15,21.8 C25.2 12.35,21.85 10.65,23.55 IC30.5 | R10.2 7.1,15.3 v7.6,14.8 | R16.2 v4.9,25 | v9.01,47.4 v9,47.4 | 11.95,56.85 v12,56.8 | IC4.21 IC4.23 5.08,77.15 IC4.24 4.75,76.45 IC4.25 4.95,75.35 v4.9,75.3 | IC4.18 IC4.16 IC4.14 IC4.12 IC4.10 IC4.8 4.75,83.05 IC4.7 5,83.3 v5,84.2 | IC4.1 8.05,84.15 v8,84.2 | IC4.31 8.05,75.35 v8.1,75.3 | R2.2 C23.2 v15.2,82.2 | J2.10-1 15.8,36.7 v15.4,36.3 15.4,33.69 J2.10
  A1 0.3: J2.6 v7.4,37.6 | IC5.12 v9.01,47.4 | C27.2 11.95,56.85 | U1.7 3.13,53.3 C31.2 4.79,52.41 5.24,51.96 C34.2 arc-309 5.5,50.5 v6.9,50.5 | C25.2 v15.1,22.9
  A1 0.6: C5.2 11.37,90.98 C3.2 12.46,91.06 13.3,91.9 13.3,94.2 13.4,94.3 IC2.4 IC2.2 13.02,102 | R1.2 C6.2 13.02,102.83 13.02,102 | X1.2 16.1,112.33 16.1,106.6 v14.6,106.2 15.67,106.17 C2.2 14.38,106.35 IC1.2 | C5.2 12.64,87.66 v12.7,87.6 | C5.2 13.64,87.66 v13.7,87.6 | C5.2 14.64,87.66 v14.7,87.6 | C22.2 9.15,114.45 v9.1,114.4 | C1.2 9.95,110.9 v8.8,110.9 | 13.02,102 12.25,102 v12.2,102.05
  B1 0.15: J1.5 7.2,6.1 v7.5,6.4 | J1.SHELL3 v4.5,1 | J1.SHELL v12.5,1 | J1.SHELL1 v9.7,1 | J1.SHELL2 7.2,2.4 v7.2,1 | J3.9 8.26,33.04 v8.3,33 | J3.5 J3.3 8.63,29.23 v8.7,29.3 | 5.3,107.3 SW4.B v3,107.5 | SW4.B' 10.1,107.5 v8.9,106.3 | SW2.B v5.1,95.7 | SW2.B' 11.9,95.9 v11.7,95.7 | SW3.B' 14.3,86.5 v14.4,86.6 | SW3.B 5,86.6 v2.9,86.6 | SW5.B v5.1,67.7 | SW5.B' 11.9,67.9 v12,67.8
  B1 0.3: C8.2 7.35,37.55 v7.4,37.6
  other vias: 10.15,10.65 8.55,10.65 8.55,9.05 10.15,9.05 11.75,9.05 11.75,10.7 11.75,12.25 10.15,12.25 15,89 13,89 15.5,93.5 15.5,96 8,96.5 1,91 1,86.5 4,88 3,92 2,102.5 5,102.5 4.5,106 1,110 4.5,109 1,115 4,115 7,115 8,99.5
  pour A2 (rank 2): 0.5,0.5 16.5,0.5 16.5,115.5 0.5,115.5
  pour A1 (rank 2): 0.5,115.5 16.5,115.5 16.5,87 16.5,86 0.5,86
IN  (via drill 0.3)
  A1 0.15: D1.1 1.45,16.55 v1.4,16.6 | v3.6,17.6 6.8,17.6 | IC30.14 6.75,17.64 6.8,17.6 | 6.8,17.6 8.7,17.6 9.7,16.6 13.6,16.6 14,17 14,17.3 | IC30.24 13.69,18.51 14,18.2 14,17.3 | IC4.29 v6.81,77.35 | 14,17.3 15.2,17.3 16.1,18.2 16.1,30.1 11.9,34.3 11.9,40.9 12.25,41.25 13.25,41.25 13.5,41.5 13.5,42.5 15.6,44.6 15.6,67.8 10.35,73.05 10.35,74.65 v11,75.3
  B1 0.15: v1.4,16.6 2.4,17.6 v3.6,17.6 | v6.81,77.35 6.86,77.3 9.5,77.3 11,75.8 v11,75.3
LED0  (via drill 0.3)
  A1 0.15: IC4.39 v6.95,79.47 | v7.15,86.65 7.15,90.87 8.55,92.27 v8.55,93.24
  B1 0.15: v6.95,79.47 6.64,79.78 6.64,79.89 6.34,80.19 6.02,80.19 5.92,80.3 5.44,80.3 5.17,80.57 5.17,82.89 7.09,84.81 7.09,86.65 v7.15,86.65 | v8.55,93.24 8.57,93.26 9.46,93.26 9.92,93.72 LED1.C
LED1  (via drill 0.3)
  A1 0.15: IC4.6 5.85,99.85 v8.8,102.8
  B1 0.15: v8.8,102.8 9.3,103.3 9.3,103.9 9.9,104.5 LED2.C
N$1
  A1 0.6: R1.1 10.01,105.35 IC1.5
N$2
  A1 0.15: U1.4 1.83,61.44 1.95,61.55 R41.2
N$3  (via drill 0.3)
  A1 0.15: IC4.37 7.57,78.78 7.07,78.94 6.6,78.94 v6.05,78.86
  B1 0.15: v6.05,78.86 6.53,78.86 6.6,78.94 9.86,78.94 X5.2
N$5  (via drill 0.3)
  A1 0.15: R37.1 6.5,2.7 v7.8,4
  B1 0.15: v7.8,4 7.8,5.12 J1.4
N$6
  A1 0.15: IC4.22 IC4.20
N$7  (via drill 0.3)
  A1 0.15: v6.24,80.72 6.17,80.67 5.72,81.12 IC4.11 | T3.3 4.78,66.32 3.9,67.2 v3.9,71.7
  B2 0.15: v6.24,80.72 5.52,80.72 4.8,80 4.8,76.9 5.4,76.3 5.4,75.54 5.42,75.52 5.42,74.92 3.9,73.4 v3.9,71.7
N$8
  cutout A2: 0.5,85.6 4.5,85.6 4.5,82 4.5,73.9 0.5,73.9
  cutout B2: 0.5,85.6 4.5,85.6 4.5,82 4.5,73.9 0.5,73.9
N$9  (via drill 0.3)
  A1 0.15: IC5.19 13.55,45.55 v13.7,45.4 | IC30.15 7.41,19.39 v7.1,19.7
  B1 0.15: v7.1,19.7 7.1,23.3 8.8,25 11.2,25 14.4,28.2 14.4,34.5 13.6,35.3 13.6,37.6 14.4,38.4 14.4,44.1 13.7,44.8 v13.7,45.4
N$11
  A1 0.15: U1.3 2.55,59.01 R40.2
N$12
  A1 0.3: X3.2 2.25,47.65 1.2,48.7 1.2,52.9 1.83,53.53 U1.5
N$16
  A1 0.3: C29.1 3.46,44.21 X3.1
N$17  (via drill 0.3)
  A1 0.15: IC4.9 5.54,82.03 5.95,81.61 v6.59,81.44 | v12.99,79.3 X5.1
  B1 0.15: v12.99,79.3 11.45,80.84 7.19,80.84 v6.59,81.44
N$18
  A1 0.3: U1.8 3.79,55.62 3.4,56 1.2,56 0.7,55.5 0.7,47.5 1.21,46.99 C29.2
N$31
  A1 0.15: IC3.35 7.39,9.1 6.8,9.1 6.4,8.7 6.4,7.1 5.5,6.2 5.15,6.2 R6.1
N$34  (via drill 0.3)
  A1 0.3: v13.5,115.2 13.5,114.6 13.35,114.45 R8.2
  B1 0.3: J1.1 9.8,4.2 10,4 16,4 16.5,4.5 16.5,113.7 15.1,115.1 13.6,115.1 v13.5,115.2
N$35
  A1 0.15: IC3.32 6.85,10.65 6.5,11 6.15,11 | 6.15,11 R7.2 5.9,11.15 | 6.15,11 4.6,11 C20.2 1.95,11.15 1.8,11.3 1.8,11.95 Y1.1
N$36
  A1 0.15: IC3.33 6.1,10.15 | 6.1,10.15 R7.1 | 6.1,10.15 4.6,10.15 | 4.6,10.15 C21.1 | 4.6,10.15 3.25,10.15 Y1.3
N$37
  A1 0.6: C22.1 R8.1 13.2,111.65 13.2,109.1 12.9,108.8 12.25,108.8 R9.2
N$38
  A1 0.15: J2.5 4.1,36.5 2.9,35.3 2.9,31.2 4.4,29.7 7.6,29.7 8.05,29.25 IC30.9
N$39
  A1 0.15: R18.2 9.1,45 9.65,45.55 IC5.13
N$40
  A1 0.15: R19.1 C26.1 8.28,46.3 IC5.11
N$41  (via drill 0.3)
  A1 0.15: IC5.16 v11.6,45.4 | IC30.17 8.71,19.59 v8.6,19.7
  B1 0.15: v8.6,19.7 8.6,24 9.1,24.5 11.2,24.5 14.8,28.1 14.8,35 14.1,35.7 14.1,37.1 14.8,37.8 14.8,45.7 14.4,46.1 12.2,46.1 11.6,45.5 v11.6,45.4
N$42  (via drill 0.3)
  A1 0.15: IC5.15 10.96,45.66 v10.7,45.4 | IC30.18 9.36,19.93 v9.4,19.98
  B1 0.15: 9.4,20 v9.4,19.98 9.4,23.6 9.9,24.1 11.5,24.1 15.2,27.8 15.2,35.3 14.6,35.9 14.6,36.8 15.2,37.4 15.2,45.9 14.5,46.6 11.3,46.6 10.7,46 v10.7,45.4
N$43
  A1 0.15: J2.1 9,32.1 11.3,29.8 IC30.4
N$44
  A1 0.15: IC30.12 6.11,27.8 5.6,28.3 4,28.3 1.5,30.8 1.5,37.05 4.25,39.8 J2.8
N$45
  A1 0.15: J2.2 5.6,32.9 4.4,32.9 4.2,32.7 4.2,31.5 4.6,31.1 9,31.1 10.01,30.09 IC30.6
N$46
  A1 0.15: R17.1 4.65,19.4 4.1,19.4 2.9,20.6 2.59,20.6 T2.1 2.27,21.62 1.82,22.08 T1.3
N$48
  A1 0.15: R20.2 R11.2 5.15,101.45 6.3,102.6 SW1.A SW1.A'
N$49
  A1 0.15: R10.1 arc-90 4.4,15.65 4.4,16.2 3.7,16.9 2.5,16.9 2.4,17 D1.3 2.1,17.7 1.5,17.7 1.31,17.89 T2.3
N$50  (via drill 0.3)
  A1 0.15: v12.74,29.86 12.8,29.91 12.8,32.6 11.1,34.3 11.1,41.2 11.6,41.7 12.4,41.7 12.8,42.1 12.8,42.9 15.2,45.3 15.2,59.5 14.9,59.8 v14.9,60 | IC4.30 7.15,69.2 7.65,68.7 7.65,64.35 v12,60
  B1 0.15: J3.4 12.22,29.23 12.79,29.8 | 12.79,29.8 12.86,29.87 | v12,60 v14.9,60 | v12.74,29.86 12.79,29.8
N$53  (via drill 0.3)
  A1 0.15: v13.12,40.55 16.1,43.53 16.1,68.24 11,73.34 v11,74.5 | v6.5,74.5 IC4.28
  B1 0.15: J3.2 12.48,27.96 13.27,28.75 13.27,34 12.5,34.77 12.5,38.33 13.27,39.1 13.27,40.4 v13.12,40.55 | v6.5,74.5 9.89,74.45 10.95,74.45 v11,74.5
N$54
  B1 0.15: R27.1 LED1.A
N$55
  A1 0.15: R31.1 C23.1 R2.1 12.45,79.95 12.25,79.75 IC4.40
N$61
  B1 0.15: R28.1 LED2.A
N$65
  A1 0.3: T3.1 10.55,65.36 X2.1
N$68  (via drill 0.3)
  A1 0.15: v6.12,79.67 5.83,80.36 5.69,80.5 IC4.13 | v1.83,89.13 1.83,99.58 R20.1
  B1 0.15: v1.83,89.13 1.87,89.09 1.87,85.96 2.91,84.92 5.21,84.92 5.72,84.41 5.72,84.02 4.77,83.07 4.77,79.67 | v6.12,79.67 4.77,79.67 | 4.77,79.67 4.77,75.91 3.13,74.27 3.13,63.83 2.35,63.05 0.95,63.05 0.38,62.48 0.38,34.23 0.9,33.7 | 2.4,34 9.9,34 10,33.9 10,33.2 9.9,33.1 | 9.9,33.1 9.8,33 | J3.10 9.96,33.04 9.9,33.1
  B1 0.152: 0.9,33.7 2.1,33.7 2.4,34
NCD1  (via drill 0.3)
  A1 0.15: T1.1 2.59,23.8 3.1,23.8 3.9,23 3.9,22.6 4.1,22.4 4.75,22.4 R16.1
  A1 0.3: T1.1 2.27,25.27 3.2,26.2 3.2,28.2 0.9,30.5 v0.9,34.8 | v3.7,34.9 4.2,35.4 J2.4
  B1 0.3: v0.9,34.8 3.7,34.8 v3.7,34.9 4.2,35.4 C8.1
NEXT  (via drill 0.3)
  A1 0.15: IC4.3 v6.95,82.15 | v15.47,79.3 16.1,78.67 16.1,72.9 v14.9,71.7 | v14.2,47.8 IC5.20
  B1 0.15: v6.95,82.15 7.75,82.15 8.65,83.05 13.15,83.05 15.5,80.7 15.5,79.3 v15.47,79.3 | v14.2,47.8 15.5,49.1 15.5,71.1 v14.9,71.7
PLAY  (via drill 0.3)
  A1 0.15: IC4.35 v6.82,78.41 | IC5.5 11.61,54.7 11.97,55.08 12.22,55.08 12.6,55.46 12.6,57.3 6.7,63.2 5.38,63.2 3.38,65.2 3.38,71.92 3.4,71.94 3.4,72 3.46,72 3.68,72.22 4.12,72.22 4.44,71.9 v5,71.9
  B2 0.15: v5,71.9 5,74.08 5.72,74.8 5.72,76.22 6.3,76.8 7.3,76.8 7.5,77 7.5,77.8 6.89,78.41 v6.82,78.41
PREV  (via drill 0.3)
  A1 0.15: IC5.1 14.21,59.09 14,59.3 14,63.5 13,64.5 13,68.2 10.4,70.8 10.4,71.9 9.7,72.6 v9.7,75.28 | IC4.32 8.75,77.15 8.9,77 8.9,76.6 v8.92,76.62
  B1 0.15: v9.7,75.28 9.7,75.84 v8.92,76.62
PWM
  A1 0.15: C26.2 R19.2 5.75,48.6 6.35,49.2 7.6,49.2 8.36,49.95 IC5.10
PWR  (via drill 0.3)
  A1 0.15: IC3.21 11.15,14.35 v11.2,14.4 | v6.6,13.3 5.8,13.3 5.1,14 4,14 3.7,14.3 3.7,14.85 D1.2
  B1 0.15: v11.2,14.4 10.1,13.3 v6.6,13.3
RESET  (via drill 0.3)
  A1 0.15: v6.95,80.33 IC4.43 | v11.5,70.9 15.2,67.2 15.2,62 14.38,61.17 14.38,59.78 14.65,59.51 14.65,52.85 12.26,50.45 IC5.17
  B2 0.15: v11.5,70.9 12.5,71.9 v12.5,74.1
  B1 0.15: v6.95,80.33 10.27,80.33 12.5,78.1 12.5,75.24 12.47,75.22 12.47,74.78 12.5,74.76 v12.5,74.1
SDCS  (via drill 0.3)
  A1 0.15: IC5.18 v12.9,45.41 v12.9,45.4 | IC30.13 6,18.62 v6,19.7
  B1 0.15: v6,19.7 6,23.1 8.5,25.6 11.2,25.6 13.9,28.3 13.9,34.2 13,35.1 13,38.1 13.9,39 13.9,43.7 12.9,44.7 v12.9,45.4
SDDI
  A1 0.15: IC30.7 9.36,29.84 8.7,30.5 4.5,30.5 3.7,31.3 3.7,33.7 4.3,34.3 J2.3
SDDO
  A1 0.15: IC30.10 7.41,28.2 6.7,28.9 4.3,28.9 2.2,31 2.2,36.7 4.2,38.7 J2.7
SPK+
  A1 0.15: R40.1 5.8,60.4 X4.1
  A1 0.3: IC5.7 10.3,54.8 9.4,55.7 9.4,56.8 X4.1
SPK-  (via drill 0.3)
  A1 0.15: X4.2 5.78,59.58 v5.8,59.6 | v5.8,61.1 5.4,61.5 3.89,61.5 R41.1
  A1 0.3: IC5.8 9.65,54.74 8.9,55.5 7.2,55.5 X4.2
  B1 0.15: v5.8,59.6 v5.8,61.1
TASTE0  (via drill 0.3)
  A1 0.15: v14.6,85.3 14.5,85.2 11.4,85.2 10.6,84.4 10.6,81.2 9.8,80.4 IC4.42
  B1 0.15: SW2.A 9,101 | 9,101 SW2.A' | v14.6,85.3 15.8,86.5 15.8,91.1 15.4,91.5 13.8,91.5 13.3,92 13.3,92.6 14.2,93.5 14.2,97.5 13.6,98.1 11,98.1 9,100.1 9,101
  B1 0.3: R21.1 12.65,101.15 12.5,101 SW2.A'
TASTE1  (via drill 0.3)
  A1 0.15: v7.7,89.8 7.7,86.3 10.2,83.8 10.2,81.6 9.65,81.05 IC4.44
  B1 0.15: R22.1 12.4,90.65 | 12.4,90.65 12.05,90.65 SW3.A' | SW3.A 7.8,90.5 | 7.8,90.5 12.25,90.5 12.4,90.65 | 7.8,90.5 7.8,89.9 v7.7,89.8
TASTE2  (via drill 0.3)
  A1 0.15: IC4.46 9.5,81.7 9.8,82 9.8,83.46 v7.73,85.53
  B1 0.15: R23.1 4.2,113 4.2,111.4 5.1,111.4 SW4.A | SW4.A SW4.A' | SW4.A 4.5,110.9 4.5,109.8 3.8,109.1 1.9,109.1 1.1,108.3 1.1,91.8 4.9,88 7,88 7.8,87.2 7.8,85.59 v7.73,85.53
TASTE3  (via drill 0.3)
  A1 0.15: IC4.48 9.05,82.35 v9.1,82.4
  B1 0.15: SW5.A' 11.5,73 11.5,71.8 10.8,71.1 6.1,71.1 5.6,71.6 5.6,72.5 SW5.A | v9.1,82.4 10.9,82.4 13.62,79.67 13.62,77.14 15.7,75.07 15.7,73.6 15.25,73.15 R24.1
  B1 0.3: R24.1 14.35,73 SW5.A'
V+
  A1 0.15: R31.2 16.5,86.15 16.5,97 15.3,98.2 15.3,100.09 IC2.1
  A1 0.6: IC2.1 15.33,103.04 C6.1 15.23,104.07 14.8,104.5 11.8,104.5 11.3,105 11.3,106.9 11.7,107.3 IC1.3 12.7,107.3 13.47,108.07 C2.1 14.72,108.23 X1.1
VDD18
  A1 0.15: IC3.13 13.65,10.15 13.9,9.9 14.25,9.9 C14.1
VDD18PLL
  A1 0.15: IC3.34 6.75,9.65 6,8.9 6,7.5 5.7,7.2 C19.1
VUB_RESET  (via drill 0.3)
  A1 0.15: IC3.18 14.4,12.65 C15.1 R4.2 14.55,15.79 16.52,17.76 16.52,30.34 14.88,31.98 14.88,39.98 16.52,41.63 16.52,68.6 14.3,70.82 14.3,72.2 15.6,73.5 15.6,75.48 14.6,76.48 11.44,76.48 10.67,75.71 v10.35,75.71 | 6.05,76.83 IC4.27 v6.05,77.35
  B1 0.15: v6.05,77.35 6.75,76.65 7.49,76.65 8.62,75.52 8.62,75.34 9.2,74.76 10.06,74.76 10.35,75.05 v10.35,75.71

### Text on the board
A1: A1 (top) | FHNW FS18
A2: A2
B2: B2
B1: B1 (bottom)